# EAGLE design Modular_Link_PCB (EAGLE 9.6.2)
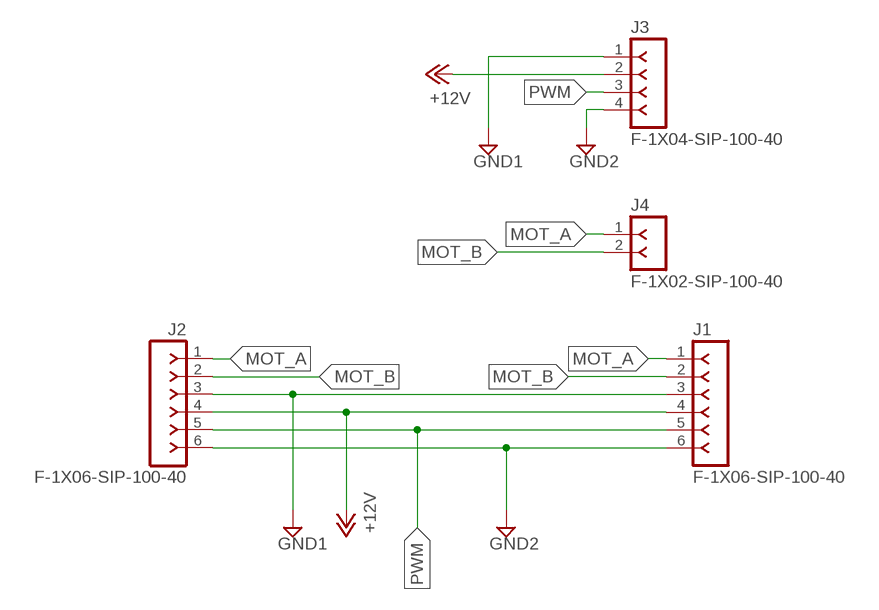
[diagram p0: schematic, sheet 1]

## Parts
J1  F-1X06-SIP-100-40  [SIP-100-06-40]
J2  F-1X06-SIP-100-40  [SIP-100-06-40]
J3  F-1X04-SIP-100-40  [SIP-100-04-40]
J4  F-1X02-SIP-100-40  [SIP-100-02-40]

## Nets
+12V: J1.4 J2.4 J3.2
GND1: J1.3 J2.3 J3.1
GND2: J1.6 J2.6 J3.4
MOT_A: J1.1 J2.1 J4.1
MOT_B: J1.2 J2.2 J4.2
PWM: J1.5 J2.5 J3.3

## Library data of the parts
J1 J2 = con-headers-jp:F-1X06-: FEMALE HEADER
J3 = con-headers-jp:F-1X04-: FEMALE HEADER
J4 = con-headers-jp:F-1X02-: FEMALE HEADER

## Board
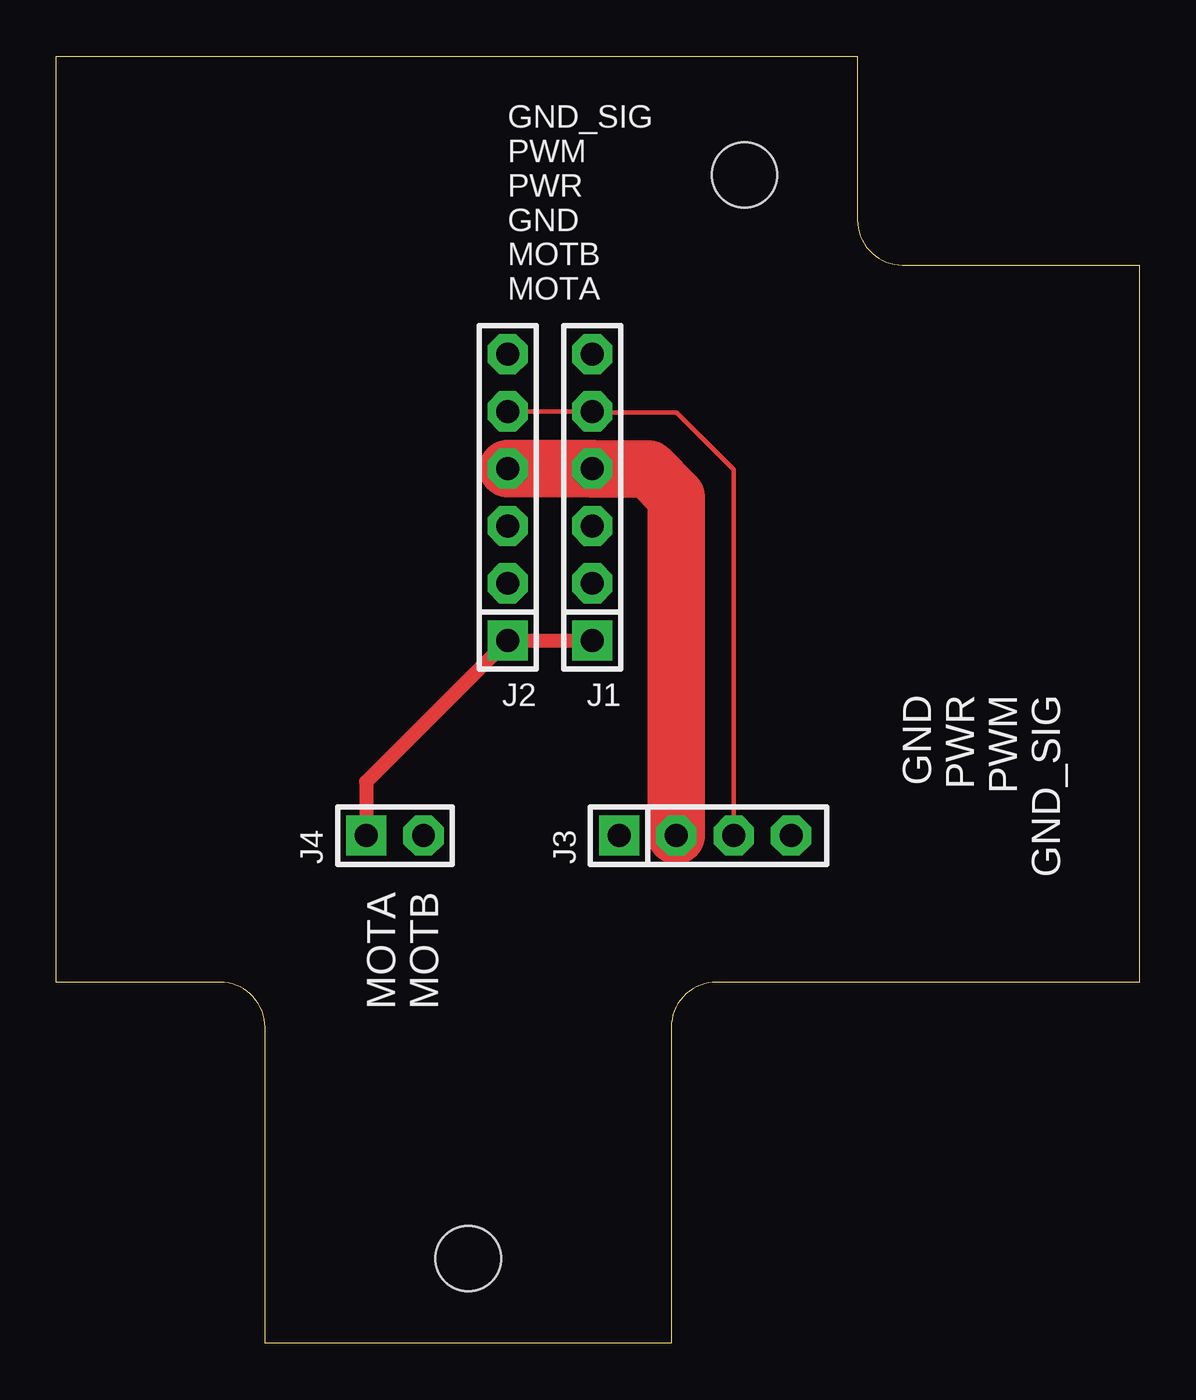
[diagram p1: board, top side]
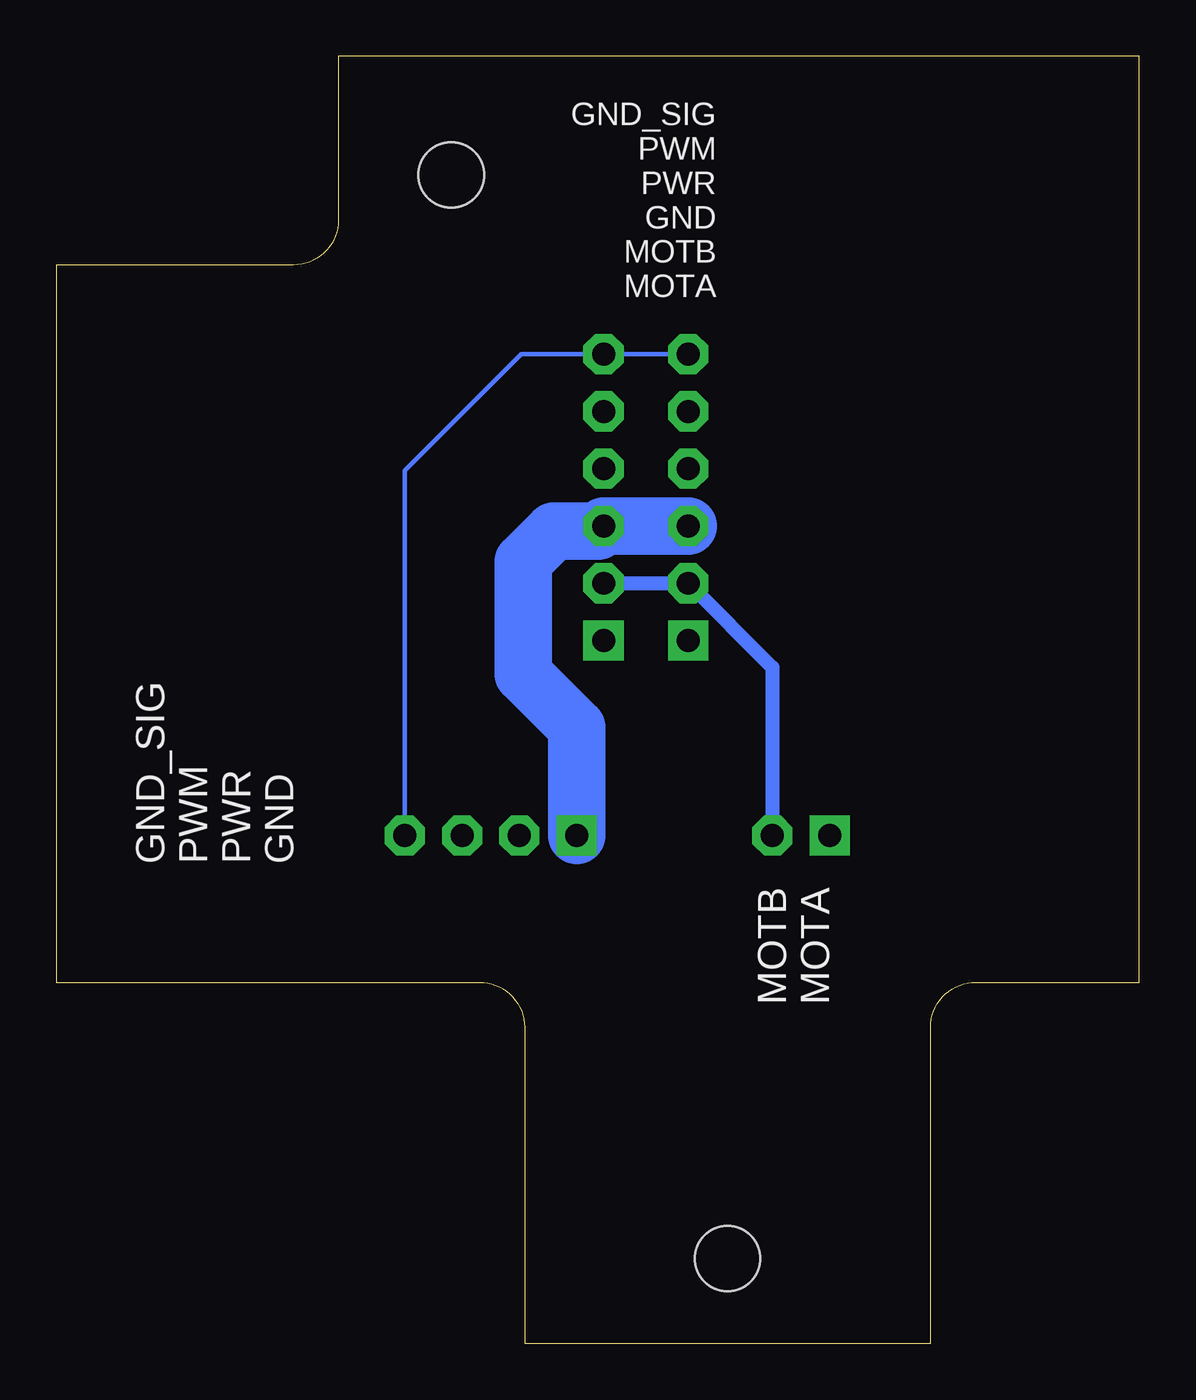
[diagram p2: board, bottom side, seen from below]

Size 48 x 57.05 mm. Coordinates in mm from the lower left corner, seen from the top.
Outline: 9.25,0 9.25,14 arc90 7.25,16 0,16 0,57.05 35.5,57.05 35.5,49.8 arc90 37.5,47.8 48,47.8 48,16 29.25,16 arc90 27.25,14 27.25,0 9.25,0
Copper layers (1*16): Top 0.035mm / dielectric 1.5mm / Bottom 0.035mm
Design rules "default": minimum track width 6mil, minimum drill 0.35mm, track to track 6mil, track to pad 6mil, pad to pad 6mil, via to via 6mil, smd to smd 6mil, copper to edge 40mil, drill to drill 6mil, minimum pad ring 10mil, minimum via ring 8mil, stop-mask expansion 4mil, vias tented up to drill 0mil, thermal gap 10mil
Holes 2.9 mm at 30.5,51.8 18.25,3.75

### Footprints (pad centres in the part's own frame; a part is rotated, then mirrored left to right if it is on the bottom)
SIP-100-06-40 = drill 1.016 pad 1.778 square: 1 -6.35,0 | drill 1.016 pad 1.778 octagon: 2 -3.81,0; 3 -1.27,0; 4 1.27,0; 5 3.81,0; 6 6.35,0
SIP-100-04-40 = drill 1.016 pad 1.778 square: 1 -3.81,0 | drill 1.016 pad 1.778 octagon: 2 -1.27,0; 3 1.27,0; 4 3.81,0
SIP-100-02-40 = drill 1.016 pad 1.778 square: 1 -1.27,0 | drill 1.016 pad 1.778 octagon: 2 1.27,0

### Placement (x,y rotation side)
J1  23.75,37.5 90 top
J2  20,37.5 90 top
J3  28.75,22.5 0 top
J4  15,22.5 0 top

### Tracks (layer width: path | path; a pad name or v marks a point on that pad's centre or on a via)
+12V
  Top 2.54: J2.4 J1.4 23.77,38.75 26.25,38.75 27.48,37.52 J3.2
GND1
  Bottom 2.54: J2.3 J1.3 23.98,36 25.96,36 27.31,34.65 27.31,29.67 24.94,27.3 J3.1
GND2
  Bottom 0.203: J2.6 J1.6 27.4,43.85 32.56,38.69 J3.4
MOT_A
  Top 0.61: J1.1 J2.1 13.73,24.88 J4.1
MOT_B
  Bottom 0.61: J1.2 J2.2 16.27,29.96 J4.2
PWM
  Top 0.203: J2.5 J1.5 23.81,41.25 27.5,41.25 30.02,38.73 J3.3

### Text on the board
tNames: GND_SIG / PWM / PWR / GND / MOTB / MOTA | GND / PWR / PWM / GND_SIG | MOTA / MOTB
bNames: GND_SIG / PWM / PWR / GND / MOTB / MOTA | GND_SIG / PWM / PWR / GND | MOTB / MOTA